# Altium project mini_fly.PrjPcb
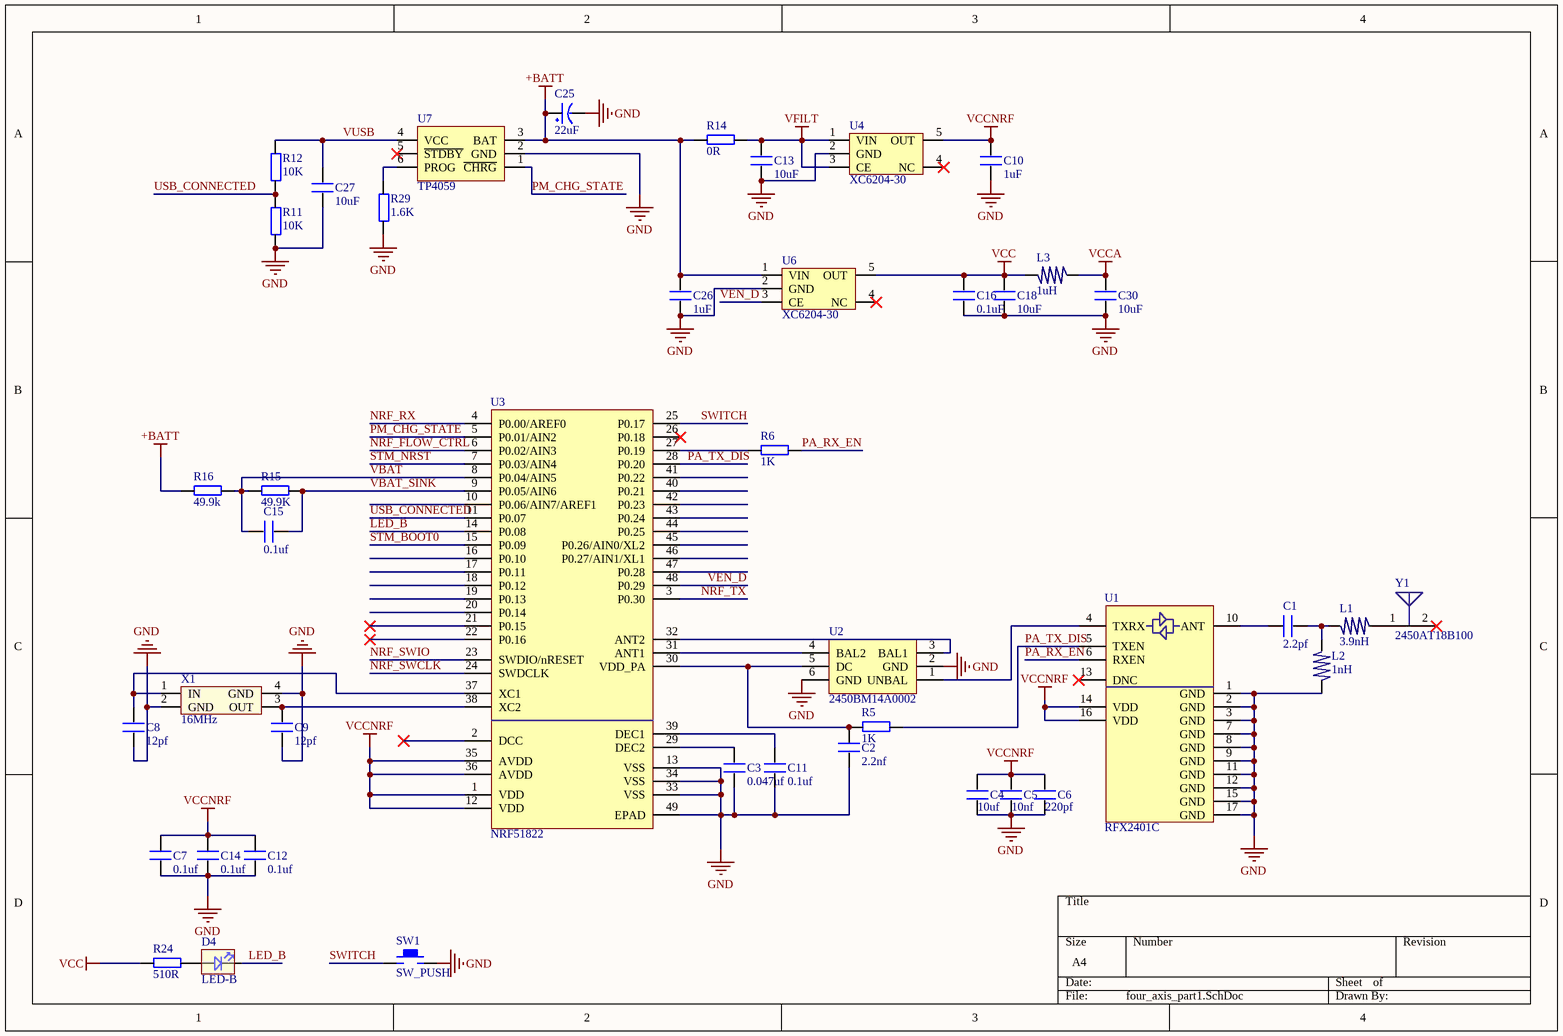
[diagram p0: four_axis_part1.SchDoc]
3 sheets, 98 parts. Net scope: global (net labels, ports and power ports of the same name join across sheets).
Board file: four_axis_v1.PcbDoc
Sheets:
  four_axis_part1.SchDoc
  four_axis_part2.SchDoc
  four_axis_part3.SchDoc

## Sheet four_axis_part1.SchDoc: NRF51822
size A4

### Parts
C1  2.2pf  [0603P]
C2  2.2nf  [0603P]
C3  0.047uf  [0603P]
C4  10uf  [0603P]
C5  10nf  [0603P]
C6  220pf  [0603P]
C7  0.1uf  [0603P]
C8  12pf  [0603P]
C9  12pf  [0603P]
C10  1uF  [0603P]
C11  0.1uf  [0603P]
C12  0.1uf  [0603P]
C13  10uF  [0603P]
C14  0.1uf  [0603P]
C15  0.1uf  [0603P]
C16  0.1uF  [0603P]
C18  10uF  [0603P]
C25  22uF  [C0805 钽电容]
C26  1uF  [0603P]
C27  10uF  [0603P]
C30  10uF  [0603P]
D4  LED-B  [LED1206  侧贴]
L1  3.9nH  [0603P]
L2  1nH  [0603P]
L3  1uH  [0603P]
R5  1K  [0402]
R6  1K  [0402]
R11  10K  [0402]
R12  10K  [0402]
R14  0R  [0402]
R15  49.9K  [0402]
R16  49.9k  [0402]
R24  510R  [0402]
R29  1.6K  [0402]
SW1  SW_PUSH  [KEY_2S]
U1  RFX2401C  [QFN16M]
U2  2450BM14A0002  [0603-6]
U3  NRF51822  [QFN48M-04]
U4  XC6204-30  [SOT23-5S]
U6  XC6204-30  [SOT23-5S]
U7  TP4059  [SOT23-6S]
X1  16MHz  [XTAL3225   无源]
Y1  2450AT18B100  [1206]

### Nets
+BATT: C25.1(VCC) C26.2 R14.2 R16.2 U6.1(VIN) U7.3(BAT)
GND: C2.1 C3.2 C4.1 C5.1 C6.1 C7.2 C8.2 C9.2 C10.1 C11.2 C12.2 C13.1 C14.2 C16.1 C18.1 C25.2(GND) C26.1 C27.1 C30.1 L2.2 R11.1 R29.1 SW1.2 U1.1(GND) U1.2(GND) U1.3(GND) U1.7(GND) U1.8(GND) U1.9(GND) U1.11(GND) U1.12(GND) U1.15(GND) U1.17(GND) U2.2(GND) U2.6(GND) U3.13(VSS) U3.33(VSS) U3.34(VSS) U3.49(EPAD) U4.2(GND) U6.2(GND) U7.2(GND) X1.2(GND) X1.4(GND)
VCC: C16.2 C18.2 L3.2 R24.2 U6.5(OUT)
VCCA: C30.2 L3.1
VCCNRF: C4.2 C5.2 C6.2 C7.1 C10.2 C12.1 C14.1 U1.14(VDD) U1.16(VDD) U3.1(VDD) U3.12(VDD) U3.35(AVDD) U3.36(AVDD) U4.5(OUT)
VFILT: C13.2 R14.1 U4.1(VIN) U4.3(CE)
VUSB: C27.2 R12.2 U7.4(VCC)
LED_B: D4.1 U3.14(P0.08)
NRF_FLOW_CTRL: U3.6(P0.02/AIN3)
NRF_RX: U3.4(P0.00/AREF0)
NRF_SWCLK: U3.24(SWDCLK)
NRF_SWIO: U3.23(SWDIO/nRESET)
NRF_TX: U3.3(P0.30)
PA_RX_EN: R6.1 U1.6(RXEN)
PA_TX_DIS: R5.1 U1.5(TXEN) U3.28(P0.20)
PM_CHG_STATE: U3.5(P0.01/AIN2) U7.1(~{CHRG})
STM_BOOT0: U3.15(P0.09)
STM_NRST: U3.7(P0.03/AIN4)
SWITCH: SW1.1 U3.25(P0.17)
USB_CONNECTED: R11.2 R12.1 U3.11(P0.07)
VBAT: C15.2 R15.2 R16.1 U3.8(P0.04/AIN5)
VBAT_SINK: C15.1 R15.1 U3.9(P0.05/AIN6)
VEN_D: U3.48(P0.29) U6.3(CE)
NetC1_1: C1.1 L1.1 L2.1
NetC1_2: C1.2 U1.10(ANT)
NetC2_2: C2.2 R5.2 U2.5(DC) U3.30(VDD_PA)
NetC3_1: C3.1 U3.29(DEC2)
NetC8_1: C8.1 U3.37(XC1) X1.1(IN)
NetC9_1: C9.1 U3.38(XC2) X1.3(OUT)
NetC11_1: C11.1 U3.39(DEC1)
NetD4_3: D4.3 R24.1
NetL1_2: L1.2 Y1.1(FP)
NetR6_2: R6.2 U3.27(P0.19)
NetR29_2: R29.2 U7.6(PROG)
NetU1_4: U1.4(TXRX) U2.1(UNBAL)
NetU2_3: U2.3(BAL1) U3.32(ANT2)
NetU2_4: U2.4(BAL2) U3.31(ANT1)

Not connected (* = marked no-connect by the designer): D4 2; U1 13(DNC)*; U3 2(DCC)* 10(P0.06/AIN7/AREF1) 16(P0.10) 17(P0.11) 18(P0.12) 19(P0.13) 20(P0.14) 21(P0.15)* 22(P0.16)* 26(P0.18)* 40(P0.21) 41(P0.22) 42(P0.23) 43(P0.24) 44(P0.25) 45(P0.26/AIN0/XL2) 46(P0.27/AIN1/XL1) 47(P0.28); U4 4(NC)*; U6 4(NC)*; U7 5(~{STDBY})*; Y1 2(NC)*

### Library data of the parts
C1-C16 C18 C26 C27 C30 = C
C25 = CAP
D4 = LED 1206 侧贴  单色
L1-L3 = L
R5 R6 R11 R12 R14-R16 R24 R29 = R
SW1 = KEY
U2 = BALUN
U4 U6 = XC6204
X1 = XTAL-无源贴片: 无源贴片晶振
Y1 = CHIP_ANTENNA

## Sheet four_axis_part2.SchDoc
size A4
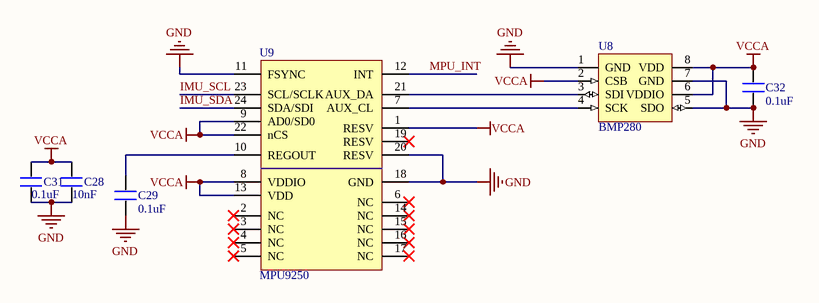
[diagram p1: four_axis_part2.SchDoc]

### Parts
C28  10nF  [0603P]
C29  0.1uF  [0603P]
C31  0.1uF  [0603P]
C32  0.1uF  [0603P]
U8  BMP280  [LGA-8]
U9  MPU9250  [QFN24-0.4]

### Nets
GND: C28.1 C29.1 C31.1 C32.1 U8.1(GND) U8.5(SDO) U8.7(GND) U9.11(FSYNC) U9.18(GND) U9.20(RESV)
VCCA: C28.2 C31.2 C32.2 U8.2(CSB) U8.6(VDDIO) U8.8(VDD) U9.1(RESV) U9.8(VDDIO) U9.9(AD0/SD0) U9.13(VDD) U9.22(nCS)
IMU_SCL: U9.23(SCL/SCLK)
IMU_SDA: U9.24(SDA/SDI)
MPU_INT: U9.12(INT)
NetC29_2: C29.2 U9.10(REGOUT)
NetU8_3: U8.3(SDI) U9.21(AUX_DA)
NetU8_4: U8.4(SCK) U9.7(AUX_CL)

Not connected (* = marked no-connect by the designer): U9 2(NC)* 3(NC)* 4(NC)* 5(NC)* 6(NC)* 14(NC)* 15(NC)* 16(NC)* 17(NC)* 19(RESV)*

### Library data of the parts
C28 C29 C31 C32 = C

## Sheet four_axis_part3.SchDoc
size A4
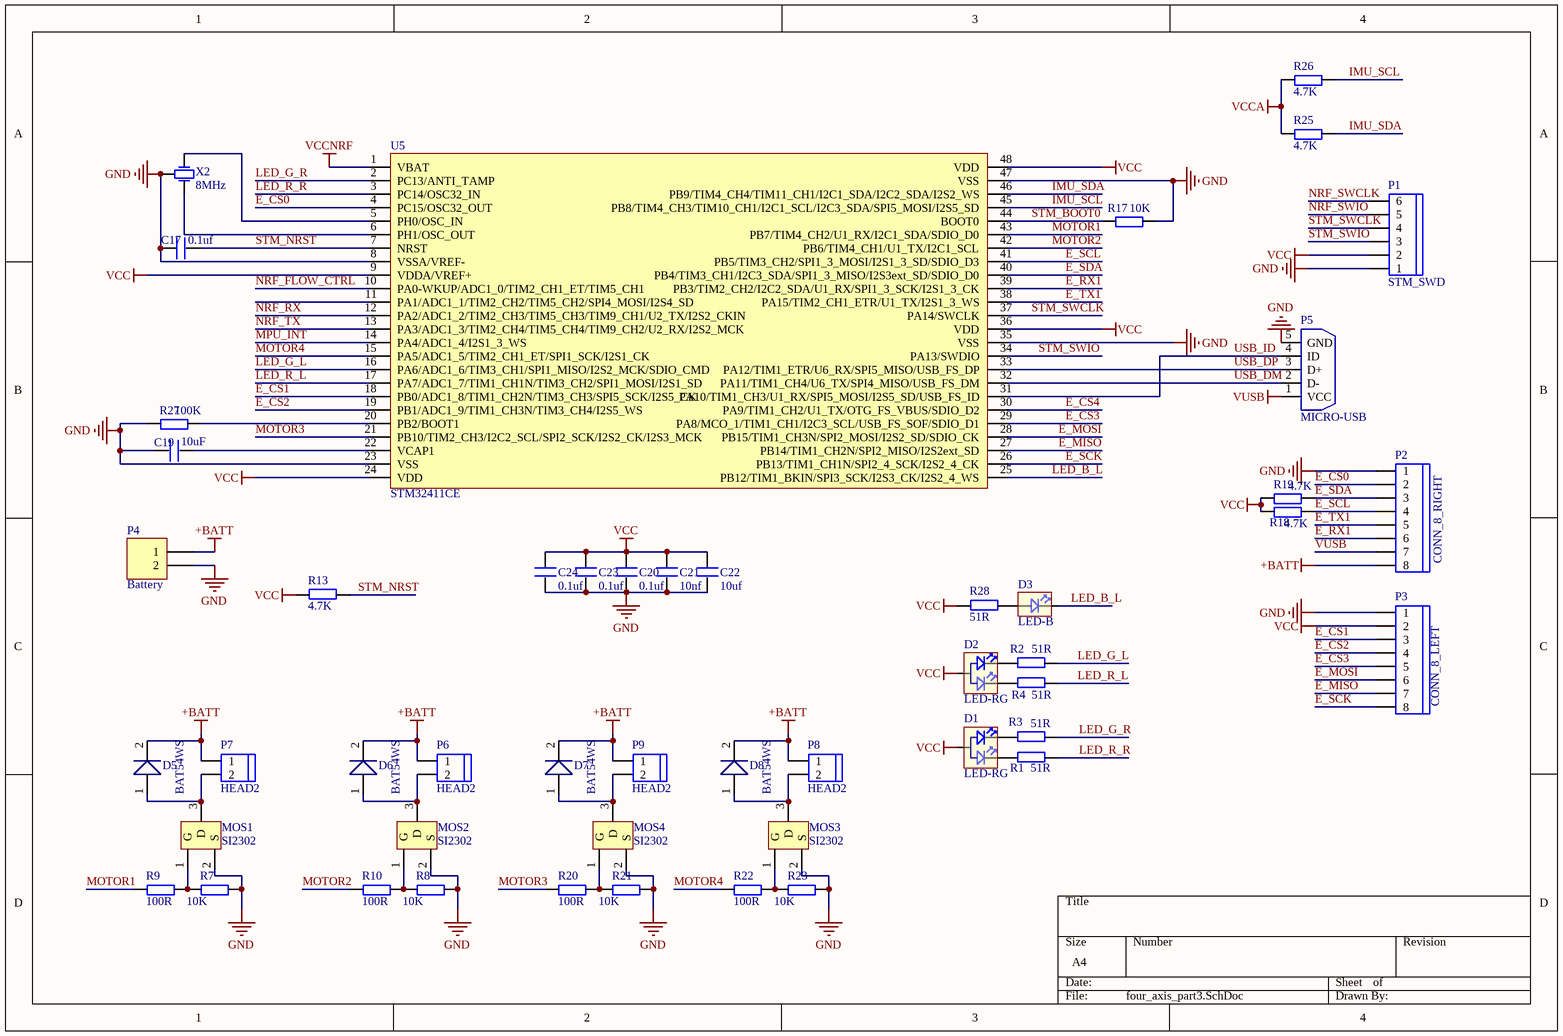
[diagram p2: four_axis_part3.SchDoc]

### Parts
C17  0.1uf  [0603P]
C19  10uF  [0603P]
C20  0.1uf  [0603P]
C21  10nf  [0603P]
C22  10uf  [0603P]
C23  0.1uf  [0603P]
C24  0.1uf  [0603P]
D1  LED-RG  [LED1206  侧贴]
D2  LED-RG  [LED1206  侧贴]
D3  LED-B  [LED1206  侧贴]
D5  BAT54WS  [SOD-323]
D6  BAT54WS  [SOD-323]
D7  BAT54WS  [SOD-323]
D8  BAT54WS  [SOD-323]
MOS1  SI2302  [SO-G3/C2.5]
MOS2  SI2302  [SO-G3/C2.5]
MOS3  SI2302  [SO-G3/C2.5]
MOS4  SI2302  [SO-G3/C2.5]
P1  STM_SWD  [SH1.0-6P]
P2  CONN_8_RIGHT  [HEADER8-2.0MM]
P3  CONN_8_LEFT  [HEADER8-2.0MM]
P4  Battery  [HDR1X2]
P5  MICRO-USB  [MICRO_USB5P_SOP]
P6  HEAD2  [HEADER2-1.25MM]
P7  HEAD2  [HEADER2-1.25MM]
P8  HEAD2  [HEADER2-1.25MM]
P9  HEAD2  [HEADER2-1.25MM]
R1  51R  [0402]
R2  51R  [0402]
R3  51R  [0402]
R4  51R  [0402]
R7  10K  [0402]
R8  10K  [0402]
R9  100R  [0402]
R10  100R  [0402]
R13  4.7K  [0402]
R17  10K  [0402]
R18  4.7K  [0402]
R19  4.7K  [0402]
R20  100R  [0402]
R21  10K  [0402]
R22  100R  [0402]
R23  10K  [0402]
R25  4.7K  [0402]
R26  4.7K  [0402]
R27  100K  [0402]
R28  51R  [0402]
U5  STM32411CE  [UFQFPN48]
X2  8MHz  [XTAL3215]

### Nets
+BATT: D5.2 D6.2 D7.2 D8.2 P2.8 P4.1 P6.1 P7.1 P8.1 P9.1
GND: C17.1 C19.1 C20.1 C21.1 C22.1 C23.1 C24.1 MOS1.2(S) MOS2.2(S) MOS3.2(S) MOS4.2(S) P1.1 P2.1 P3.1 P4.2 P5.5(GND) R7.2 R8.2 R17.2 R21.2 R23.2 R27.1 U5.8(VSSA/VREF-) U5.23(VSS) U5.35(VSS) U5.47(VSS) X2.2(GND)
VCC: C20.2 C21.2 C22.2 C23.2 C24.2 D1.3 D2.3 P1.2 P3.2 R13.2 R18.1 R19.1 R28.2 U5.9(VDDA/VREF+) U5.24(VDD) U5.36(VDD) U5.48(VDD)
VCCA: R25.1 R26.1
VCCNRF: U5.1(VBAT)
VUSB: P2.7 P5.1(VCC)
E_CS0: P2.2 U5.4(PC15/OSC32_OUT)
E_CS1: P3.3 U5.18(PB0/ADC1_8/TIM1_CH2N/TIM3_CH3/SPI5_SCK/I2S5_CK)
E_CS2: P3.4 U5.19(PB1/ADC1_9/TIM1_CH3N/TIM3_CH4/I2S5_WS)
E_CS3: P3.5 U5.29(PA8/MCO_1/TIM1_CH1/I2C3_SCL/USB_FS_SOF/SDIO_D1)
E_CS4: U5.30(PA9/TIM1_CH2/U1_TX/OTG_FS_VBUS/SDIO_D2)
E_MISO: P3.7 U5.27(PB14/TIM1_CH2N/SPI2_MISO/I2S2ext_SD)
E_MOSI: P3.6 U5.28(PB15/TIM1_CH3N/SPI2_MOSI/I2S2_SD/SDIO_CK)
E_RX1: P2.6 U5.39(PB3/TIM2_CH2/I2C2_SDA/U1_RX/SPI1_3_SCK/I2S1_3_CK)
E_SCK: P3.8 U5.26(PB13/TIM1_CH1N/SPI2_4_SCK/I2S2_4_CK)
E_SCL: P2.4 R18.2 U5.41(PB5/TIM3_CH2/SPI1_3_MOSI/I2S1_3_SD/SDIO_D3)
E_SDA: P2.3 R19.2 U5.40(PB4/TIM3_CH1/I2C3_SDA/SPI1_3_MISO/I2S3ext_SD/SDIO_D0)
E_TX1: P2.5 U5.38(PA15/TIM2_CH1_ETR/U1_TX/I2S1_3_WS)
IMU_SCL: R26.2 U5.45(PB8/TIM4_CH3/TIM10_CH1/I2C1_SCL/I2C3_SDA/SPI5_MOSI/I2S5_SD)
IMU_SDA: R25.2 U5.46(PB9/TIM4_CH4/TIM11_CH1/I2C1_SDA/I2C2_SDA/I2S2_WS)
LED_B_L: D3.1 U5.25(PB12/TIM1_BKIN/SPI3_SCK/I2S3_CK/I2S2_4_WS)
LED_G_L: R2.1 U5.16(PA6/ADC1_6/TIM3_CH1/SPI1_MISO/I2S2_MCK/SDIO_CMD)
LED_G_R: R3.1 U5.2(PC13/ANTI_TAMP)
LED_R_L: R4.1 U5.17(PA7/ADC1_7/TIM1_CH1N/TIM3_CH2/SPI1_MOSI/I2S1_SD)
LED_R_R: R1.1 U5.3(PC14/OSC32_IN)
MOTOR1: R9.1 U5.43(PB7/TIM4_CH2/U1_RX/I2C1_SDA/SDIO_D0)
MOTOR2: R10.1 U5.42(PB6/TIM4_CH1/U1_TX/I2C1_SCL)
MOTOR3: R20.1 U5.21(PB10/TIM2_CH3/I2C2_SCL/SPI2_SCK/I2S2_CK/I2S3_MCK)
MOTOR4: R22.1 U5.15(PA5/ADC1_5/TIM2_CH1_ET/SPI1_SCK/I2S1_CK)
MPU_INT: U5.14(PA4/ADC1_4/I2S1_3_WS)
NRF_FLOW_CTRL: U5.10(PA0-WKUP/ADC1_0/TIM2_CH1_ET/TIM5_CH1)
NRF_RX: U5.12(PA2/ADC1_2/TIM2_CH3/TIM5_CH3/TIM9_CH1/U2_TX/I2S2_CKIN)
NRF_SWCLK: P1.6
NRF_SWIO: P1.5
NRF_TX: U5.13(PA3/ADC1_3/TIM2_CH4/TIM5_CH4/TIM9_CH2/U2_RX/I2S2_MCK)
STM_BOOT0: R17.1 U5.44(BOOT0)
STM_NRST: C17.2 R13.1 U5.7(NRST)
STM_SWCLK: P1.4 U5.37(PA14/SWCLK)
STM_SWIO: P1.3 U5.34(PA13/SWDIO)
USB_DM: P5.2(D-) U5.32(PA11/TIM1_CH4/U6_TX/SPI4_MISO/USB_FS_DM)
USB_DP: P5.3(D+) U5.33(PA12/TIM1_ETR/U6_RX/SPI5_MISO/USB_FS_DP)
USB_ID: P5.4(ID) U5.31(PA10/TIM1_CH3/U1_RX/SPI5_MOSI/I2S5_SD/USB_FS_ID)
NetC19_2: C19.2 U5.22(VCAP1)
NetD1_1: D1.1 R1.2
NetD1_2: D1.2 R3.2
NetD2_1: D2.1 R4.2
NetD2_2: D2.2 R2.2
NetD3_3: D3.3 R28.1
NetD5_1: D5.1 MOS1.3(D) P7.2
NetD6_1: D6.1 MOS2.3(D) P6.2
NetD7_1: D7.1 MOS4.3(D) P9.2
NetD8_1: D8.1 MOS3.3(D) P8.2
NetMOS1_1: MOS1.1(G) R7.1 R9.2
NetMOS2_1: MOS2.1(G) R8.1 R10.2
NetMOS3_1: MOS3.1(G) R22.2 R23.1
NetMOS4_1: MOS4.1(G) R20.2 R21.1
NetR27_2: R27.2 U5.20(PB2/BOOT1)
NetU5_5: U5.5(PH0/OSC_IN) X2.1(OSC1)
NetU5_6: U5.6(PH1/OSC_OUT) X2.3(OSC2)

Not connected (* = marked no-connect by the designer): D3 2; U5 11(PA1/ADC1_1/TIM2_CH2/TIM5_CH2/SPI4_MOSI/I2S4_SD)

### Library data of the parts
C17 C19-C24 = C
D1 D2 = LED 1206 侧贴 双色
D3 = LED 1206 侧贴  单色
D5-D8 = BAT54: 单肖特基二极管
MOS1-MOS4 = MOS-N: AP2306
P1 = HEAD6
P2 P3 = HEAD8
P4 = Header 2: Header, 2-Pin; LatestRevisionDate: 17-Jul-2002; LatestRevisionNote: Re-released for DXP Platform.; Publisher: Altium Limited
P5 = USB5
R1-R4 R7-R10 R13 R17-R23 R25-R28 = R
U5 = STM32F411xC_xE: STM32411xC_xE
X2 = XTAL-3215

## Nets that join several sheets
+BATT: four_axis_part1 (6 pins), four_axis_part3 (10 pins)
GND: four_axis_part1 (44 pins), four_axis_part2 (10 pins), four_axis_part3 (27 pins)
VCC: four_axis_part1 (5 pins), four_axis_part3 (17 pins)
VCCA: four_axis_part1 (C30.2 L3.1), four_axis_part2 (11 pins), four_axis_part3 (R25.1 R26.1)
VCCNRF: four_axis_part1 (14 pins), four_axis_part3 (U5.1)
VUSB: four_axis_part1 (C27.2 R12.2 U7.4), four_axis_part3 (P2.7 P5.1)
IMU_SCL: four_axis_part2 (U9.23), four_axis_part3 (R26.2 U5.45)
IMU_SDA: four_axis_part2 (U9.24), four_axis_part3 (R25.2 U5.46)
MPU_INT: four_axis_part2 (U9.12), four_axis_part3 (U5.14)
NRF_FLOW_CTRL: four_axis_part1 (U3.6), four_axis_part3 (U5.10)
NRF_RX: four_axis_part1 (U3.4), four_axis_part3 (U5.12)
NRF_SWCLK: four_axis_part1 (U3.24), four_axis_part3 (P1.6)
NRF_SWIO: four_axis_part1 (U3.23), four_axis_part3 (P1.5)
NRF_TX: four_axis_part1 (U3.3), four_axis_part3 (U5.13)
STM_BOOT0: four_axis_part1 (U3.15), four_axis_part3 (R17.1 U5.44)
STM_NRST: four_axis_part1 (U3.7), four_axis_part3 (C17.2 R13.1 U5.7)